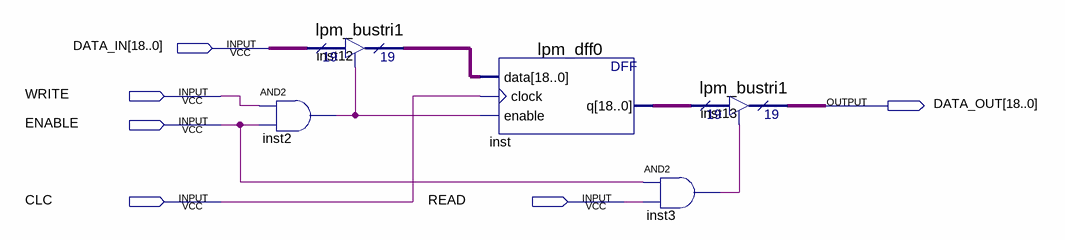
[diagram p0: schematic sheet]
// Quartus schematic CELL.bdf as structural Verilog: 5 symbols, 6 pins
module CELL (
  input  [18:0] DATA_IN,
  input  WRITE,
  input  ENABLE,
  input  CLC,
  input  READ,
  output [18:0] DATA_OUT
);

  wire inst2_out, inst3_out;
  wire [18:0] inst12_tridata, inst_q;

  and inst2 (inst2_out, WRITE, ENABLE);
  lpm_bustri1 inst12 (.enabledt(inst2_out), .data(DATA_IN), .tridata(inst12_tridata));
  lpm_dff0 inst (.data(inst12_tridata), .clock(CLC), .enable(inst2_out), .q(inst_q));
  and inst3 (inst3_out, ENABLE, READ);
  lpm_bustri1 inst13 (.enabledt(inst3_out), .data(inst_q), .tridata(DATA_OUT));
endmodule
